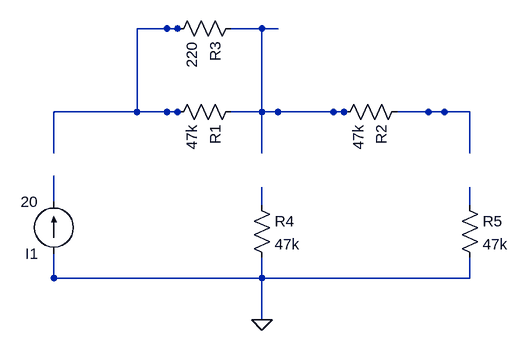
[diagram p0: schematic pannel4.asc]
pannel4.asc, the LTspice schematic file:
Version 4
SHEET 1 880 680
WIRE 464 384 537 384
WIRE 366 384 382 384
SYMBOL res 480 368 R90
SYMATTR InstName R1
SYMATTR Value 47k
WIRE 720 384 793 384
WIRE 622 384 638 384
SYMBOL res 736 368 R90
SYMATTR InstName R2
SYMATTR Value 47k
WIRE 512 528 512 500
WIRE 512 640 512 608
SYMBOL res 496 512 R0
SYMATTR InstName R4
SYMATTR Value 47k
WIRE 832 528 832 500
WIRE 832 640 832 608
SYMBOL res 816 512 R0
SYMATTR InstName R5
SYMATTR Value 47k
WIRE 464 256 537 256
WIRE 366 256 382 256
SYMBOL res 480 240 R90
SYMATTR InstName R3
SYMATTR Value 220
WIRE 192 602 192 642
WIRE 192 482 192 522
SYMBOL current 192 602 R180
SYMATTR InstName I1
SYMATTR Value 20
FLAG 512 704 0
WIRE 192 384 192 448
WIRE 192 384 256 384
WIRE 768 640 832 640
WIRE 512 640 512 704
WIRE 448 640 512 640
WIRE 512 640 576 640
WIRE 192 640 256 640
WIRE 256 384 320 384
WIRE 320 384 384 384
WIRE 320 320 320 384
WIRE 512 384 512 448
WIRE 512 320 512 384
WIRE 512 384 576 384
WIRE 832 384 832 448
WIRE 768 384 832 384
WIRE 320 256 320 320
WIRE 320 256 384 256
WIRE 512 256 512 320
WIRE 704 640 768 640
WIRE 640 640 704 640
WIRE 576 640 640 640
WIRE 384 640 448 640
WIRE 320 640 384 640
WIRE 256 640 320 640
WIRE 576 384 640 384

The netlist it stands for:
* pannel4.asc
R1 N001 N002 47k
R2 N003 N001 47k
R4 N004 0 47k
R5 N005 0 47k
R3 N001 N002 220
I1 0 N006 20
.backanno
.end